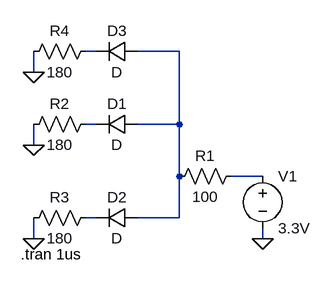
[diagram p0: schematic resistors for 7 segment display.asc]
resistors for 7 segment display.asc, the LTspice schematic file:
Version 4
SHEET 1 880 680
WIRE 176 -32 160 -32
WIRE 304 -32 240 -32
WIRE 80 0 80 -32
WIRE 176 80 160 80
WIRE 304 80 304 -32
WIRE 304 80 240 80
WIRE 80 112 80 80
WIRE 304 160 304 80
WIRE 432 160 384 160
WIRE 176 224 160 224
WIRE 304 224 304 160
WIRE 304 224 240 224
WIRE 80 256 80 224
WIRE 432 256 432 240
FLAG 432 256 0
FLAG 80 256 0
FLAG 80 112 0
FLAG 80 0 0
SYMBOL res 400 144 R90
WINDOW 0 0 56 VBottom 2
WINDOW 3 32 56 VTop 2
SYMATTR InstName R1
SYMATTR Value 100
SYMBOL res 176 64 R90
WINDOW 0 0 56 VBottom 2
WINDOW 3 32 56 VTop 2
SYMATTR InstName R2
SYMATTR Value 180
SYMBOL res 176 208 R90
WINDOW 0 0 56 VBottom 2
WINDOW 3 32 56 VTop 2
SYMATTR InstName R3
SYMATTR Value 180
SYMBOL diode 240 64 R90
WINDOW 0 0 32 VBottom 2
WINDOW 3 32 32 VTop 2
SYMATTR InstName D1
SYMBOL diode 240 208 R90
WINDOW 0 0 32 VBottom 2
WINDOW 3 32 32 VTop 2
SYMATTR InstName D2
SYMBOL voltage 432 144 R0
WINDOW 123 0 0 Left 0
WINDOW 39 0 0 Left 0
SYMATTR InstName V1
SYMATTR Value 3.3V
SYMBOL diode 240 -48 R90
WINDOW 0 0 32 VBottom 2
WINDOW 3 32 32 VTop 2
SYMATTR InstName D3
SYMBOL res 176 -48 R90
WINDOW 0 0 56 VBottom 2
WINDOW 3 32 56 VTop 2
SYMATTR InstName R4
SYMATTR Value 180
TEXT 60 280 Left 2 !.tran 1us

The netlist it stands for:
* resistors for 7 segment display.asc
R1 N004 N002 100
R2 N003 0 180
R3 N005 0 180
D1 N002 N003 D
D2 N002 N005 D
V1 N004 0 3.3V
D3 N002 N001 D
R4 N001 0 180
.model D D
.lib standard.dio
.tran 1us
.backanno
.end